# Altium schematic sheet NODE_DW1000_B_V2.SchDoc: PDOA Kit Node
size A3; Organization: Decawave Ltd.; Address1: Adelaide Chambers,; Address2: Peter Street,; Address3: Dublin 8,; Address4: Ireland.; DocumentNumber: 4; Revision: 2v2; SheetNumber: 4; SheetTotal: 5; SheetFunction: DW1000 B; ProjectName: PDOA Kit Node
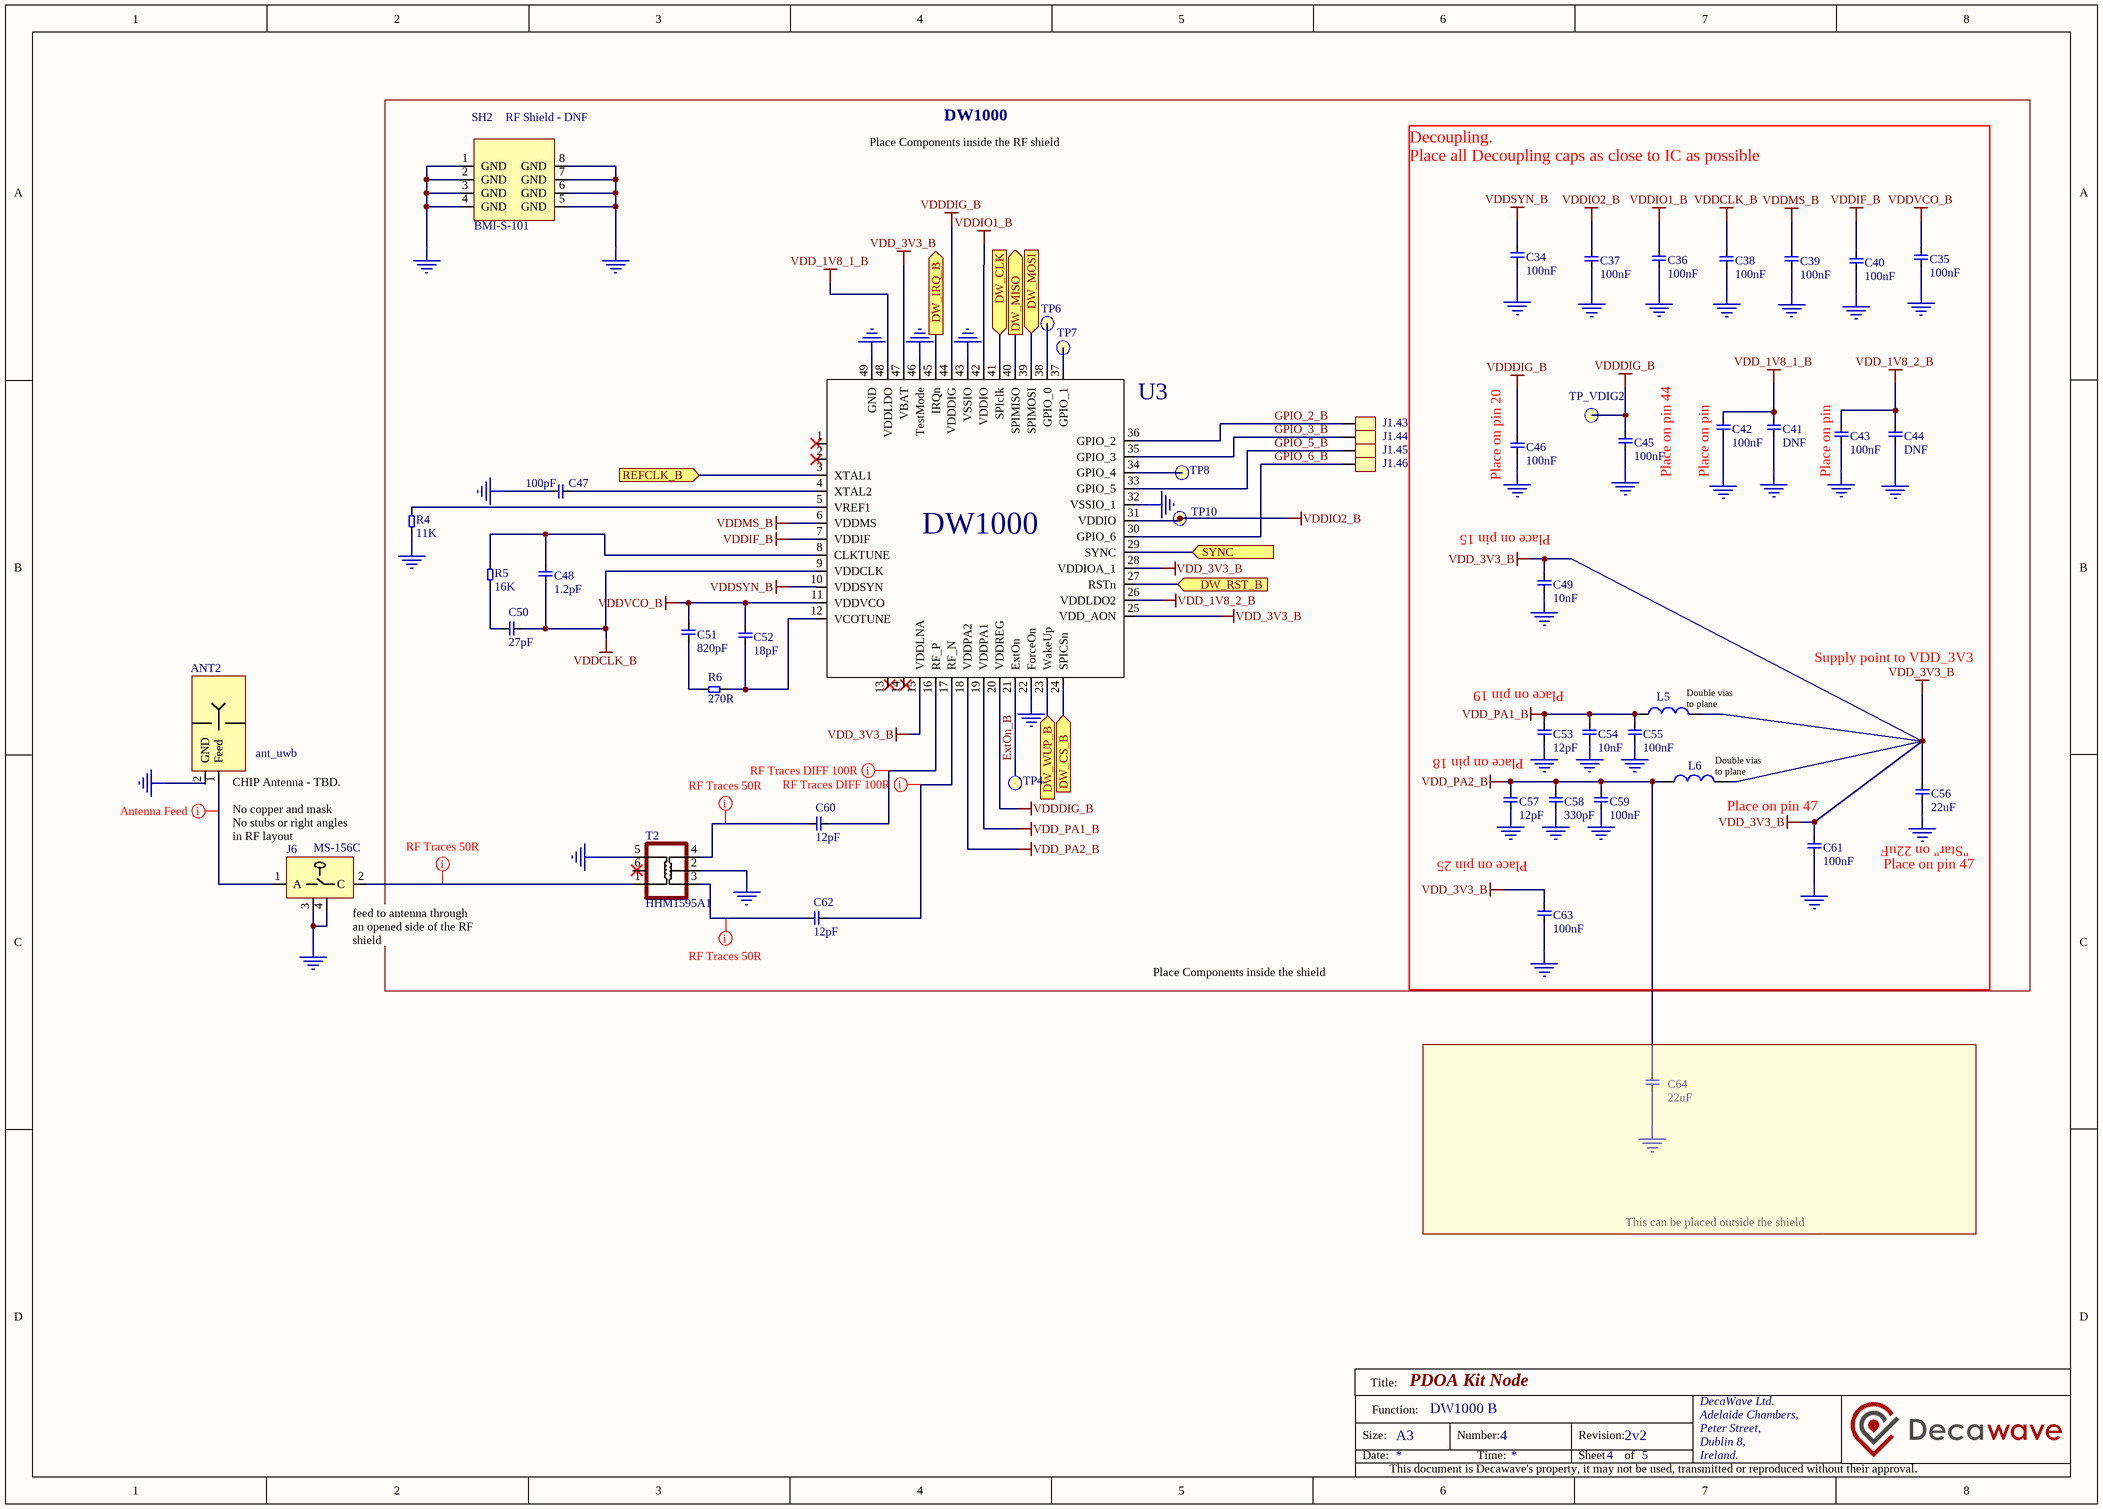
[diagram p0: NODE_DW1000_B_V2.SchDoc]

## Parts
ANT2  ant_uwb  [ANT]
C34  100nF  [C0201-C]
C35  100nF  [C0201-C]
C36  100nF  [C0201-C]
C37  100nF  [C0201-C]
C38  100nF  [C0201-C]
C39  100nF  [C0201-C]
C40  100nF  [C0201-C]
C41  DNF  [C0402]
C42  100nF  [C0201-C]
C43  100nF  [C0201-C]
C44  DNF  [C0402]
C45  100nF  [C0201-C]
C46  100nF  [C0201-C]
C47  100pF  [C0402]
C48  1.2pF  [C0201-C]
C49  10nF  [C0201-C]
C50  27pF  [C0201-C]
C51  820pF  [C0402]
C52  18pF  [C0201-C]
C53  12pF  [C0201-C]
C54  10nF  [C0201-C]
C55  100nF  [C0201-C]
C56  22uF  [C0603]
C57  12pF  [C0201-C]
C58  330pF  [C0201-C]
C59  100nF  [C0201-C]
C60  12pF  [C0201-C]
C61  100nF  [C0201-C]
C62  12pF  [C0201-C]
C63  100nF  [C0201-C]
C64  22uF  [C0603]
J1.43  EDGE_PIN  [PCB_EDGE_1MM]  (value not drawn)
J1.44  EDGE_PIN  [PCB_EDGE_1MM]  (value not drawn)
J1.45  EDGE_PIN  [PCB_EDGE_1MM]  (value not drawn)
J1.46  EDGE_PIN  [PCB_EDGE_1MM]  (value not drawn)
J6  Manufacturer Part Number: MS-156C  [RF_SWITCH_2P3X2P3]  (hidden comment: coswitch)
L5  BLM15HG601SN1D  [L0402]  (value not drawn)
L6  BLM15HG601SN1D  [L0402]  (value not drawn)
R4  11K  [R0201-C]
R5  16K  [R0201-C]
R6  270R  [R0201-C]
SH2  BMI-S-101  [RF_SH_12P7X13P66]
T2  HHM1595A1  [TRANS4_0P65_2P15X1P4]
TP4  TP  [TP_40S]  (value not drawn)
TP6  TP  [TP_40S]  (value not drawn)
TP7  TP  [TP_40S]  (value not drawn)
TP8  TP  [TP_40S]  (value not drawn)
TP10  TP  [TP_40S]  (value not drawn)
TP_VDIG2  TP  [TP_40S]  (value not drawn)
U3  DW1000 IC  [QFN48_0P4_6P0X6P0_T]  (value not drawn)

## Blocks framed on the sheet
DW1000: C34-C63 J1.43-J1.46 L5 L6 R4-R6 SH2 T2 TP4 TP6-TP8 TP10 TP_VDIG2 U3

## Ports
DW_CLK (in), DW_CS_B (in), DW_IRQ_B (out), DW_MISO (out), DW_MOSI (in), DW_RST_B (in), DW_WUP_B (in), REFCLK_B (in), SYNC (in)

## Nets
GND: ANT2.2(GND) C34.1 C35.1 C36.1 C37.1 C38.1 C39.1 C40.1 C41.1 C42.1 C43.1 C44.1 C45.1 C46.1 C47.2 C49.1 C53.1 C54.1 C55.1 C56.1 C57.1 C58.1 C59.1 C61.1 C63.1 C64.1 J6.3(GND) J6.4(GND) R4.1 SH2.1(GND) SH2.2(GND) SH2.3(GND) SH2.4(GND) SH2.5(GND) SH2.6(GND) SH2.7(GND) SH2.8(GND) T2.2 T2.5 U3.22(ForceOn) U3.32(VSSIO_1) U3.43(VSSIO) U3.46(TestMode) U3.49(GND)
VDD_1V8_1_B: C41.2 C42.2 U3.48(VDDLDO)
VDD_1V8_2_B: C43.2 C44.2 U3.26(VDDLDO2)
VDD_3V3_B: C49.2 C56.2 C61.2 C63.2 L5.2 L6.2 U3.15(VDDLNA) U3.25(VDD_AON) U3.28(VDDIOA_1) U3.47(VBAT)
VDD_PA1_B: C53.2 C54.2 C55.2 L5.1 U3.19(VDDPA1)
VDD_PA2_B: C57.2 C58.2 C59.2 C64.2 L6.1 U3.18(VDDPA2)
VDDCLK_B: C38.2 C48.1 C50.1 U3.9(VDDCLK)
VDDDIG_B: C45.2 C46.2 TP_VDIG2.1 U3.20(VDDREG) U3.44(VDDDIG)
VDDIF_B: C40.2 U3.7(VDDIF)
VDDIO1_B: C36.2 U3.42(VDDIO)
VDDIO2_B: C37.2 TP10.1 U3.31(VDDIO)
VDDMS_B: C39.2 U3.6(VDDMS)
VDDSYN_B: C34.2 U3.10(VDDSYN)
VDDVCO_B: C35.2 C51.2 C52.1 U3.11(VDDVCO)
DW_CLK: U3.41(SPIclk) ; port DW_CLK
DW_CS_B: U3.24(SPICSn) ; port DW_CS_B
DW_IRQ_B: U3.45(IRQn) ; port DW_IRQ_B
DW_MISO: U3.40(SPIMISO) ; port DW_MISO
DW_MOSI: U3.39(SPIMOSI) ; port DW_MOSI
DW_RST_B: U3.27(RSTn) ; port DW_RST_B
DW_WUP_B: U3.23(WakeUp) ; port DW_WUP_B
ExtOn_B: TP4.1 U3.21(ExtOn)
GPIO_2_B: J1.43.0 U3.36(GPIO_2)
GPIO_3_B: J1.44.0 U3.35(GPIO_3)
GPIO_5_B: J1.45.0 U3.33(GPIO_5)
GPIO_6_B: J1.46.0 U3.30(GPIO_6)
REFCLK_B: U3.3(XTAL1) ; port REFCLK_B
SYNC: U3.29(SYNC) ; port SYNC
NetANT2_1: ANT2.1(Feed) J6.1(A)
NetC47_1: C47.1 U3.4(XTAL2)
NetC48_2: C48.2 R5.2 U3.8(CLKTUNE)
NetC50_2: C50.2 R5.1
NetC51_1: C51.1 R6.2
NetC52_2: C52.2 R6.1 U3.12(VCOTUNE)
NetC60_1: C60.1 T2.4
NetC60_2: C60.2 U3.16(RF_P)
NetC62_1: C62.1 T2.3
NetC62_2: C62.2 U3.17(RF_N)
NetJ6_2: J6.2(C) T2.1
NetR4_2: R4.2 U3.5(VREF1)
NetTP6_1: TP6.1 U3.38(GPIO_0)
NetTP7_1: TP7.1 U3.37(GPIO_1)
NetTP8_1: TP8.1 U3.34(GPIO_4)

Not connected (* = marked no-connect by the designer): T2 6; U3 1* 2* 13 14

## Layout directives
net class RF Traces 50R: NetC60_1, NetC60_2, NetC62_1, NetC62_2, NetJ6_2
net class Antenna Feed: NetANT2_1

## Notes on the sheet
- (near SH2) RF Shield - DNF
- Place Components inside the RF shield
- (near C46) Place on pin 20
- Place on pin 44
- (near C42) Place on pin
- (near C43) Place on pin
- (near C49) Place on pin 15
- Place on pin 19
- (near L5) Double vias
  to plane
- Supply point to VDD_3V3
- Place on pin 18
- (near L6) Double vias
  to plane
- (near ANT2) CHIP Antenna - TBD.
  No copper and mask
  No stubs or right angles in RF layout
- Place on pin 25
- Place on pin 47
- "Star" on 22uF
- (near J6) feed to antenna through an opened side of the RF shield
- Place Components inside the shield
- Decoupling.
  Place all Decoupling caps as close to IC as possible
- This can be placed outside the shield
- Title:
- Size:
- Date:
- Function:
- A3
- Number:
- Time:
- Revision:
- Sheet
- of
- DecaWave Ltd.
- Adelaide Chambers,
- Peter Street,
- Dublin 8,
- Ireland.
- This document is Decawave's property, it may not be used, transmitted or reproduced without their approval.

## Library data of the parts
ANT2 = M10044: CHIP ANT
C34-C40 C42 C43 C45 C46 C55 C59 C61 C63 = C10051: 100nF_0201_10%; Manufacturer: Murata Electronics North America; Manufacturer Part Number: GRM033C81E104KE14D
C41 C44 = C10007: 4.7uF_0402_10%; Manufacturer: TDK; Manufacturer Part Number: C1005X5R0J475K050BC
C47 = C10017: 100pF_0402_10%; Manufacturer Part Number: GRM1555C1H101JA01D; Manufacturer: Murata Electronics North America
C48 = C10056: 1.2pF_0201_10%; Manufacturer: Murata Electronics North America; Manufacturer Part Number: GRM0335C1E1R2CA01D
C49 C54 = C10062: 10nF_0201_10%; Manufacturer: Murata Electronics North America; Manufacturer Part Number: GRM033R61E103KA12D
C50 = C10057: 27pF_0201_2%; Manufacturer: Murata Electronics North America; Manufacturer Part Number: GRM0335C1E270JA01D
C51 = C10054: 820pF_0201_2%; Manufacturer: Murata Electronics North America; Manufacturer Part Number: GRM033R71E821KA01D
C52 = C10053: 18pF_0201_1%; Manufacturer: Murata Electronics North America; Manufacturer Part Number: GRM0335C1H180JA01D
C53 C57 C60 C62 = C10060: 12pF_0201_1%; Manufacturer: Murata Electronics North America; Manufacturer Part Number: GRM0335C1E120JA01D
C56 C64 = C10059: 22uF_0603_10%; Manufacturer: Murata Electronics North America; Manufacturer Part Number: GRM188R60J226MEA0D
C58 = C10061: 330pF_0201_10%; Manufacturer: SamSung; Manufacturer Part Number: CL03B331KA3NNNC
J1.43-J1.46 = EDGE_PIN: PCB Edge pin
J6 = J10015: COAX JACK STR 50 OHM SMD; Manufacturer: Hirose
L5 L6 = M10012: FERRITE BEAD, 0.7OHM, 300MA, 0402; Manufacturer: Murata Electronics North America; Manufacturer Part Number: BLM15HG601SN1D
R4 = R10051: 11K_0201_1%; Manufacturer: Yageo; Manufacturer Part Number: RC0201FR-0711KL
R5 = R10054: 16K_0201_1%; Manufacturer: Yageo; Manufacturer Part Number: RC0201FR-0716KL
R6 = R10050: 270R_0201_1%; Manufacturer: Yageo; Manufacturer Part Number: RC0201FR-07270RL
SH2 = M10011: RF Shield 13.66x12.1mm; Manufacturer: Laird; Manufacturer Part Number: BMI-S-101
T2 = M10043: SMT UWB Balun 3-8Ghz; Manufacturer: TDK; Manufacturer Part Number: HHM1595A1
TP4 TP6-TP8 TP10 TP_VDIG2 = TP: test point
U3 = U10000: UMB Transceiver; Manufacturer: Decawave; Manufacturer Part Number: DW1000